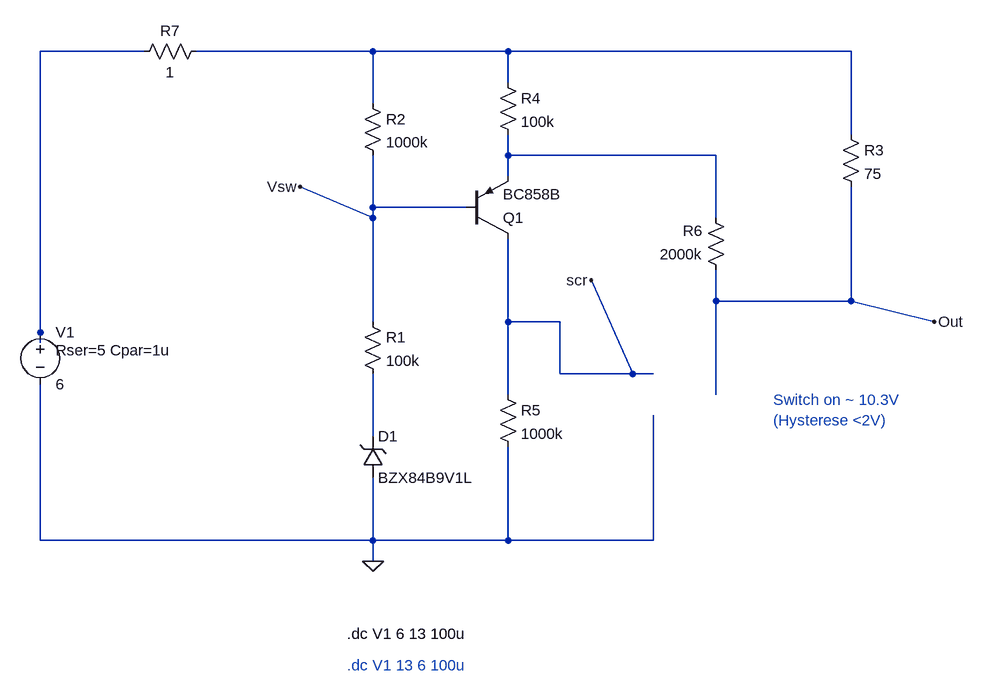
[diagram p0: schematic V0_SW.asc]
V0_SW.asc, the LTspice schematic file:
Version 4
SHEET 1 1172 680
WIRE -256 -384 -416 -384
WIRE 96 -384 -176 -384
WIRE 304 -384 96 -384
WIRE 832 -384 304 -384
WIRE 304 -336 304 -384
WIRE 96 -304 96 -384
WIRE 832 -256 832 -384
WIRE 304 -224 304 -256
WIRE 624 -224 304 -224
WIRE 304 -192 304 -224
WIRE 96 -144 96 -224
WIRE 240 -144 96 -144
WIRE 96 -128 -16 -176
WIRE 96 -128 96 -144
WIRE 624 -128 624 -224
WIRE 624 0 624 -48
WIRE 832 0 832 -176
WIRE 832 0 624 0
WIRE 96 32 96 -128
WIRE 304 32 304 -96
WIRE 384 32 304 32
WIRE 960 32 832 0
WIRE -416 48 -416 -384
WIRE -416 64 -416 48
WIRE 384 112 384 32
WIRE 496 112 432 -32
WIRE 496 112 384 112
WIRE 528 112 496 112
WIRE 304 144 304 32
WIRE 624 144 624 0
WIRE 96 208 96 112
WIRE -416 368 -416 128
WIRE 96 368 96 272
WIRE 96 368 -416 368
WIRE 304 368 304 224
WIRE 304 368 96 368
WIRE 528 368 528 176
WIRE 528 368 304 368
WIRE 96 400 96 368
FLAG 96 400 0
FLAG 432 -32 scr
FLAG 960 32 Out
FLAG -16 -176 Vsw
SYMBOL res 80 16 R0
SYMATTR InstName R1
SYMATTR Value 100k
SYMBOL res 80 -320 R0
SYMATTR InstName R2
SYMATTR Value 1000k
SYMBOL res 288 -352 R0
SYMATTR InstName R4
SYMATTR Value 100k
SYMBOL res 288 128 R0
SYMATTR InstName R5
SYMATTR Value 1000k
SYMBOL zener 80 272 M180
WINDOW 0 24 64 Left 2
WINDOW 3 24 0 Left 2
SYMATTR InstName D1
SYMATTR Value BZX84B9V1L
SYMBOL pnp 240 -96 M180
SYMATTR InstName Q1
SYMATTR Value BC858B
SYMBOL res 816 -272 R0
SYMATTR InstName R3
SYMATTR Value 75
SYMBOL voltage -416 32 R0
WINDOW 123 0 0 Left 0
WINDOW 39 24 44 Left 2
SYMATTR SpiceLine Rser=5 Cpar=1u
SYMATTR InstName V1
SYMATTR Value 6
SYMBOL res 640 -32 R180
WINDOW 0 36 76 Left 2
WINDOW 3 36 40 Left 2
SYMATTR InstName R6
SYMATTR Value 2000k
SYMBOL res -160 -400 R90
WINDOW 0 0 56 VBottom 2
WINDOW 3 32 56 VTop 2
SYMATTR InstName R7
SYMATTR Value 1
TEXT 56 512 Left 2 !.dc V1 6 13 100u
TEXT 712 152 Left 2 ;Switch on ~ 10.3V\n(Hysterese <2V)
TEXT 56 560 Left 2 ;.dc V1 13 6 100u

The netlist it stands for:
* V0_SW.asc
R1 Vsw N004 100k
R2 N002 Vsw 1000k
R4 N002 N003 100k
R5 scr 0 1000k
D1 0 N004 BZX84B9V1L
Q1 scr Vsw N003 0 BC858B
R3 N002 Out 75
V1 N001 0 6 Rser=5 Cpar=1u
R6 Out N003 2000k
R7 N002 N001 1
.model D D
.lib standard.dio
.model NPN NPN
.model PNP PNP
.lib standard.bjt
.dc V1 6 13 100u
* Switch on ~ 10.3V
* (Hysterese <2V)
* .dc V1 13 6 100u
.backanno
.end